# EasyEDA Pro project 无线充电发射板.eprj, board PCB2
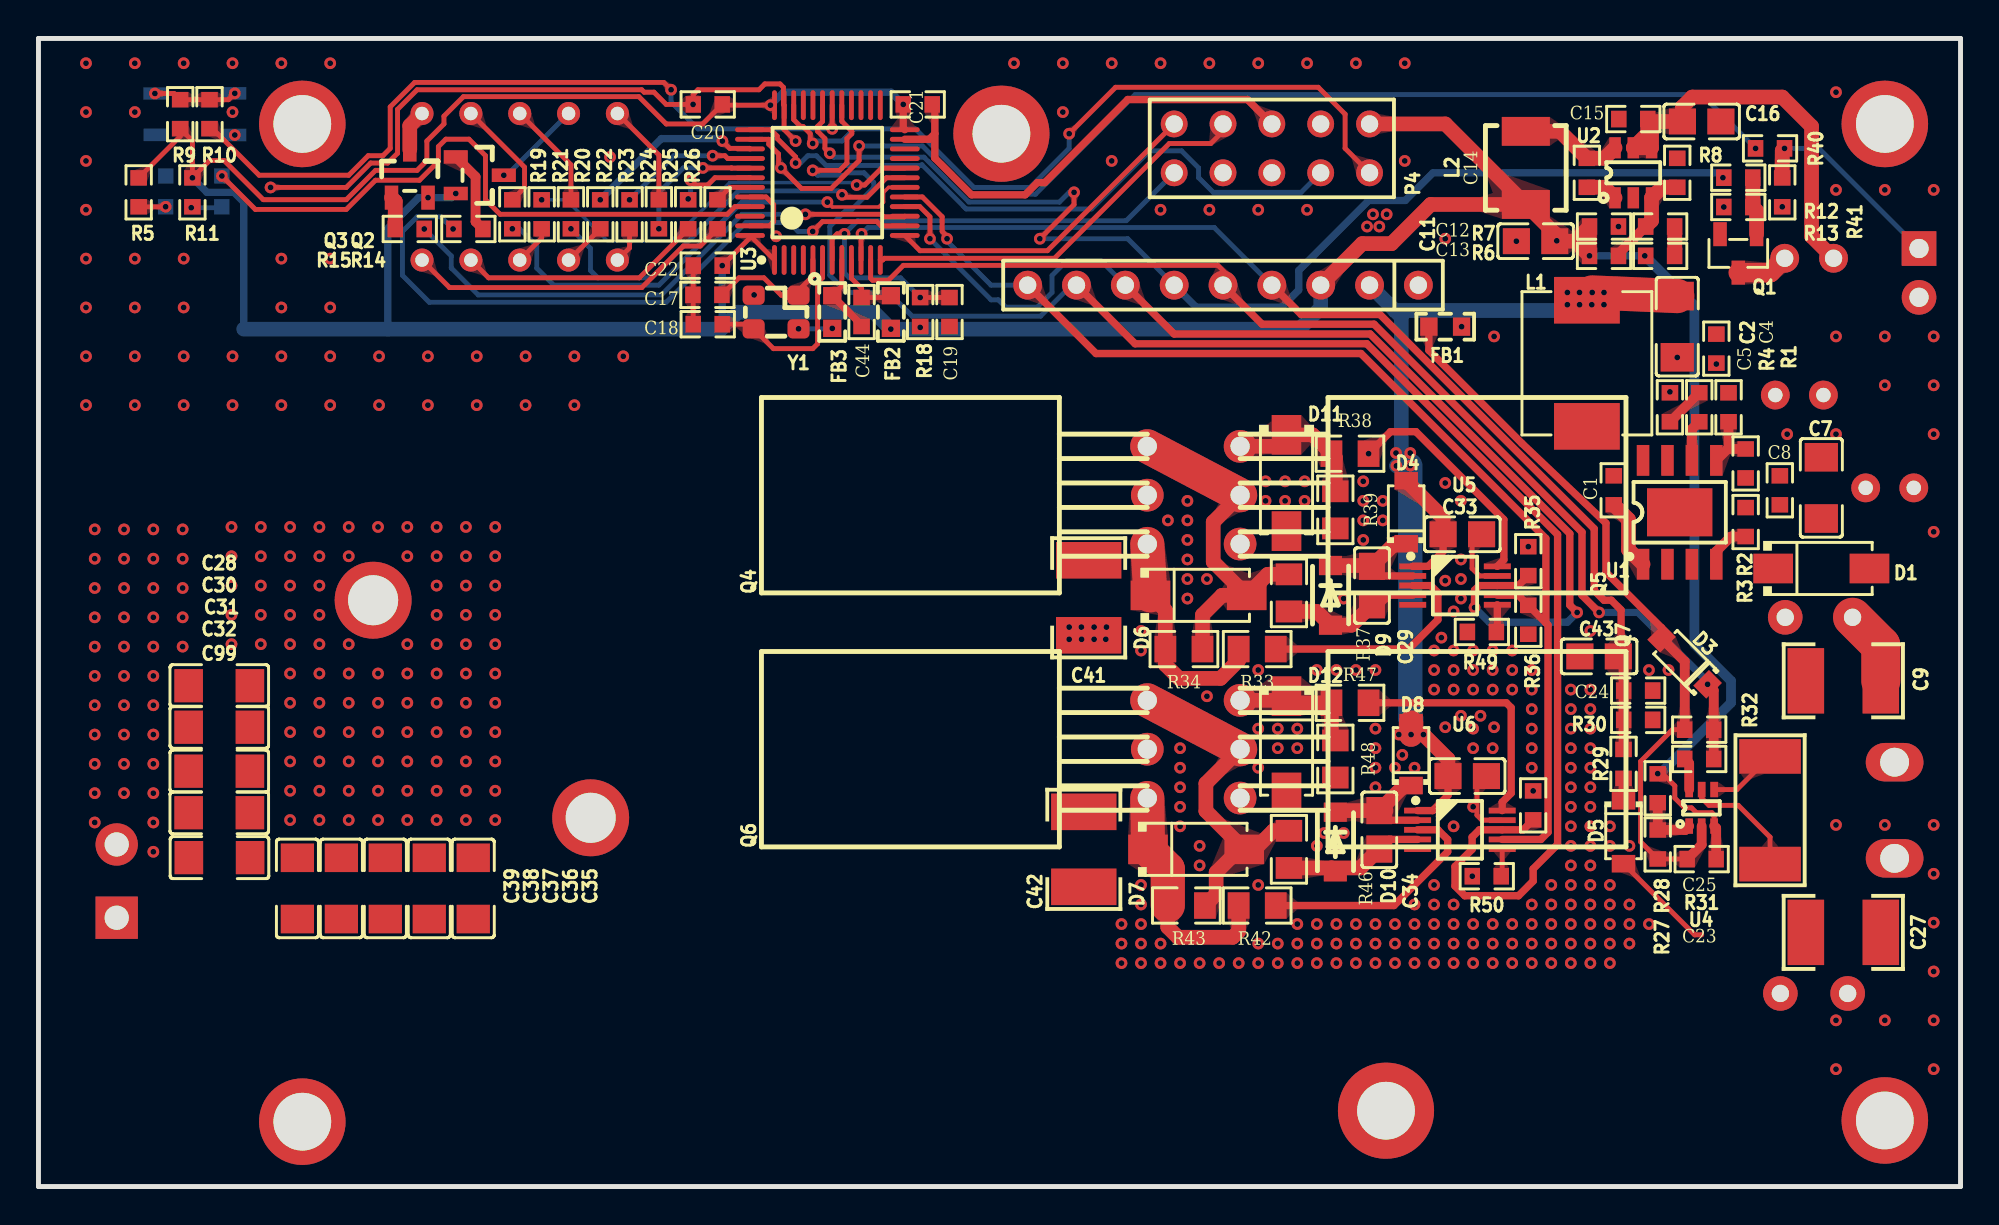
[diagram p1: board, top side]
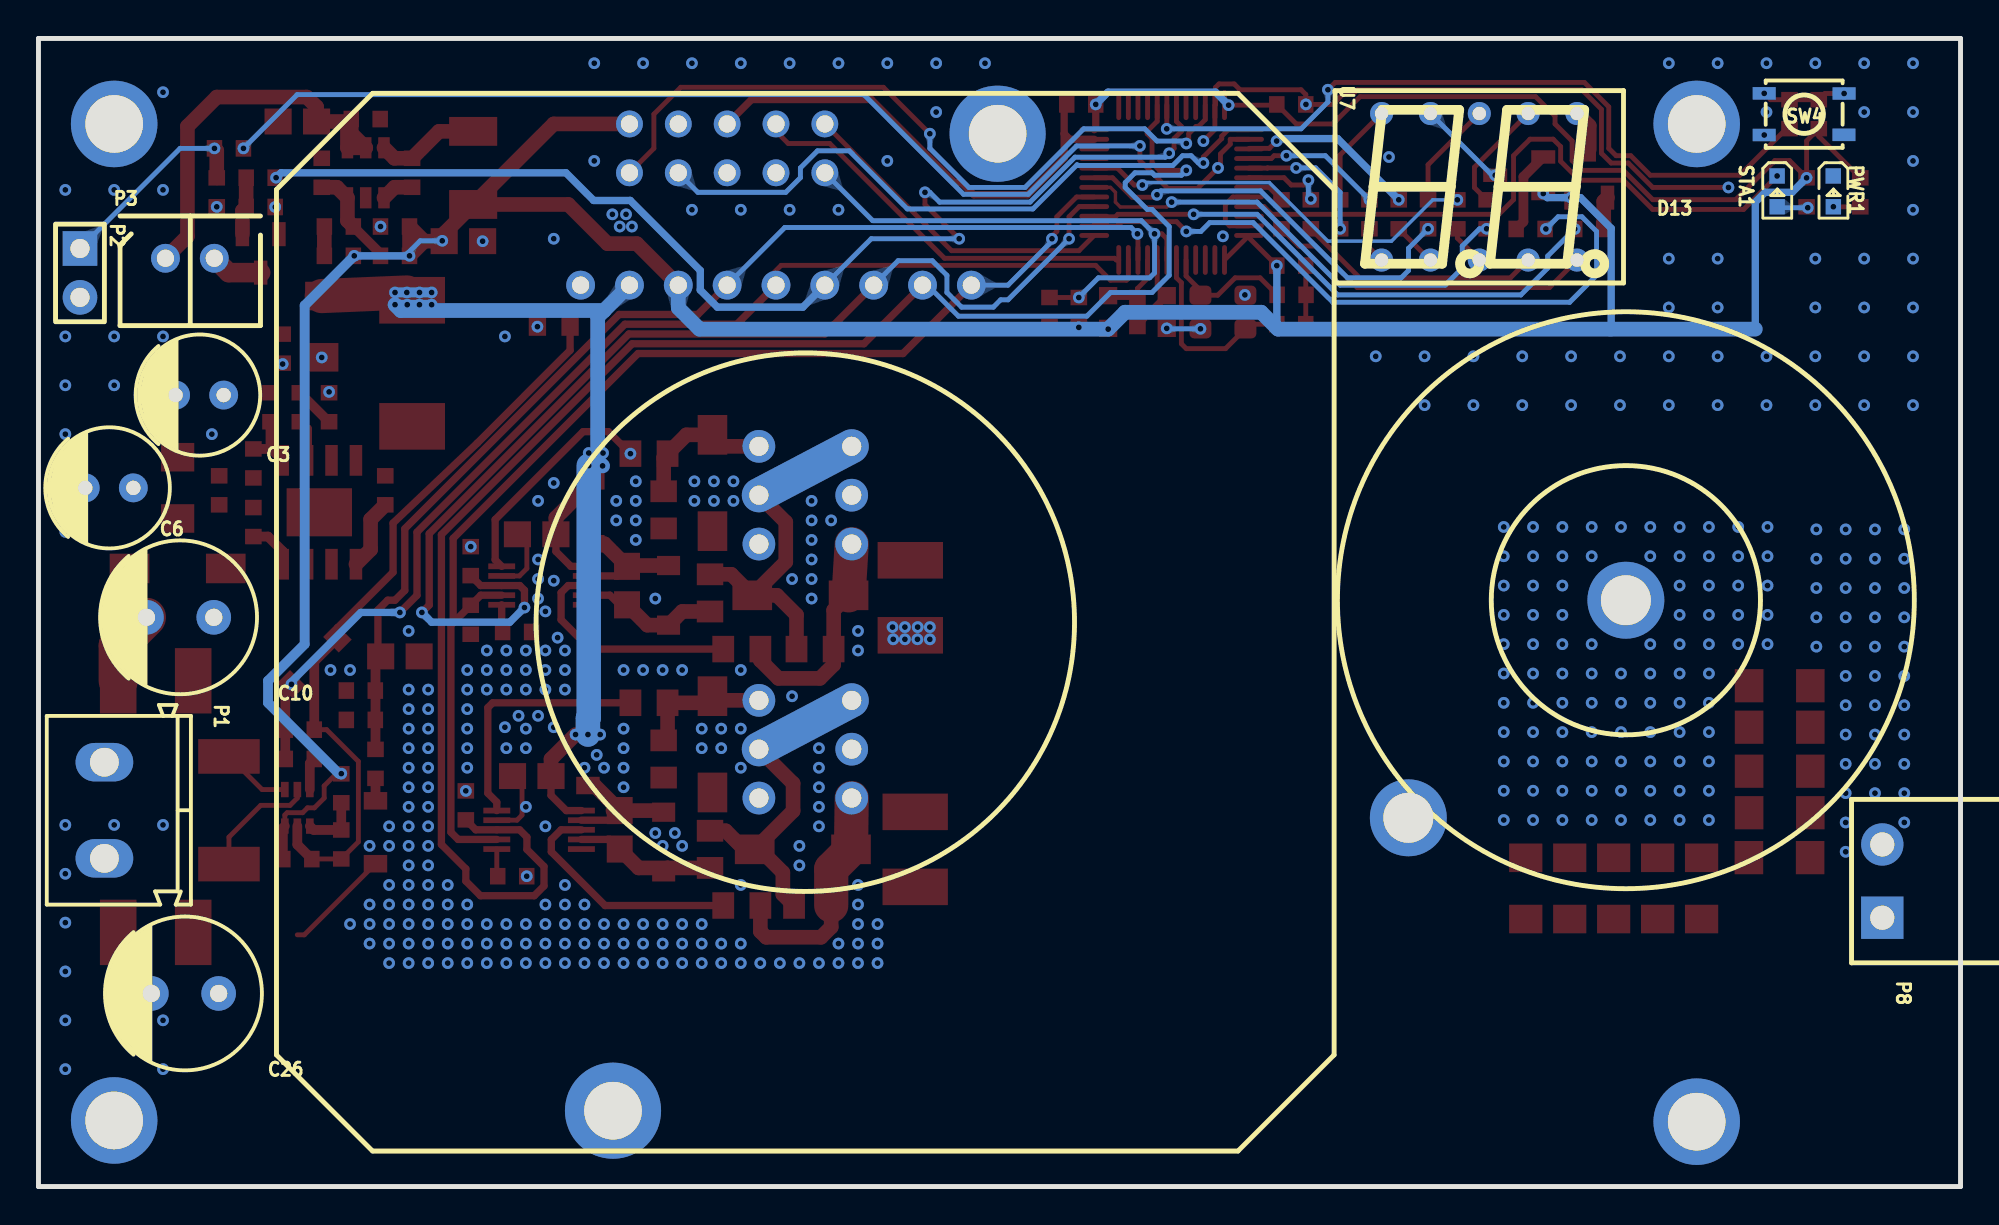
[diagram p2: board, bottom side, seen from below]

Outline 99.95 x 59.7 mm; copper layers: Top Layer, Bottom Layer. Coordinates in mm from the lower left corner of the outline.
Outline path: 0,59.69 0,0 arc(0,0) 0,0 99.95,0 arc(99.95,0) 99.95,0 99.95,59.69 arc(99.95,59.7) 99.95,59.7 0,59.7 arc(0,59.7) 0,59.69
Stack: Top Layer 0.035mm / Dielectric1 1.51mm FR4 er 4.5 / Bottom Layer 0.035mm

## Design rules (mm)
spacing copperThickness1oz (default): track to track 0.102, other pairs 0.152 to 0.3
spacing copperThickness2oz: track to track 0.203, other pairs 0.152 to 0.3
track width copperThickness1oz (default): min 0.127, default 0.254, max 2.54
track width copperThickness2oz: min 0.203, default 0.254, max 2.54
differential pair differentialPair (default): width min 0.127, default 0.254, max 2.54; gap min 0.152, default 0.152
via viaSize (default): diameter min 0.5, default 0.61, max 10; hole min 0.3, default 0.305, max 6.3
net GND uses 111
net VBATO uses 111
net $C6_1 uses 111
net $C28_1 uses 111
net $C28_2 uses 111
net VCC12V uses 111
net VBAT uses 111
net GNDMCU uses 111
net LCCA uses 111
net $C1_2 uses 111
net LCCB uses 111

## Placement (name value [footprint] x y rotation side)
C1  100nF  [R0603]  81.92 36.2 90 top
C2  47uF/25V  [C1206]  85.22 44.71 90 top
C3  220uF  [Cap-S-D 2.5-6.3X8]  91.57 41.16 0 bottom
C4  100nF/50V  [R0603]  87.25 43.57 90 top
C5  4.7nF/50V  [R0603]  84.84 40.52 270 top
C6  100uF  [Cap-S-D 2.5-6.3X8]  96.27 36.33 0 bottom
C7  4.7uF/1206/35V  [C1206]  92.72 36.33 270 top
C8  100nF/50V  [R0603]  90.56 36.2 270 top
C9  47uF  [CAPC4532[1812]S]  93.86 26.3 180 top
C10  470uF  [Cap-S-D 3.5-8x14]  92.59 29.6 0 bottom
C11  22uF  [C0805]  77.86 49.16 0 top
C12  100nF  [R0603]  81.41 49.92 180 top
C13  220pF  [R0603]  81.41 48.39 180 top
C14  100nF  [R0603]  80.52 52.71 90 top
C15  100nF  [R0603]  82.94 55.51 0 top
C16  22uF  [C0805]  86.49 55.38 180 top
C17  18pF/50V/C0G  [R0603]  34.79 46.37 180 top
C18  18pF/50V/C0G  [R0603]  34.8 44.84 0 top
C19  100nF  [R0603]  47.38 45.47 90 top
C20  100nF  [R0603]  34.8 56.27 0 top
C21  100nF  [R0603]  45.72 56.27 180 top
C22  100nF  [R0603]  34.8 47.89 0 top
C23  100nF  [R0603]  86.49 17.03 180 top
C24  100nF  [R0603]  83.19 25.79 180 top
C25  1uF  [R0603]  86.37 23.76 180 top
C26  470uF  [Cap-S-D 3.5-8x14]  92.33 10.04 0 bottom
C27  47uF  [CAPC4532[1812]S]  93.86 13.22 0 top
C28  NC/C0G  [C1206]  9.4 26.04 0 top
C29  10uF  [C0805]  69.35 31.25 90 top
C30  NC/C0G  [C1206]  9.4 23.88 0 top
C31  NC/C0G  [C1206]  9.4 21.6 0 top
C32  NC/C0G  [C1206]  9.4 19.44 0 top
C33  22uF  [C0805]  74.05 33.92 180 top
C34  10uF  [C0805]  69.73 18.55 90 top
C35  NC/C0G  [C1206]  22.61 15.5 90 top
C36  NC/C0G  [C1206]  20.33 15.5 90 top
C37  NC/C0G  [C1206]  18.04 15.5 90 top
C38  NC/C0G  [C1206]  15.75 15.5 90 top
C39  NC/C0G  [C1206]  13.47 15.5 90 top
C40  22uF  [C0805]  74.3 21.34 180 top
C41  47uF  [CAPC4532[1812]S]  54.62 30.61 90 top
C42  47uF  [CAPC4532[1812]S]  54.36 17.53 90 top
C43  10uF  [C0805]  81.16 27.57 0 top
C44  100nF  [R0603]  42.8 45.47 270 top
C99  NC/C0G  [C1206]  9.41 17.1 0 top
D1  SS54  [SMA_L4.4-W2.8-LS5.4-R-RD]  92.72 32.14 0 top
D3  SMF3.3A  [SOD-123_L2.8-W1.8-LS3.7-RD]  85.6 27.31 135 top
D4  1N4148  [SOD-123_L2.7-W1.6-LS3.7-RD]  71.12 35.06 90 top
D5  1N4148  [SOD-123_L2.7-W1.6-LS3.7-RD]  82.43 18.42 270 top
D6  SS54  [SMA_L4.4-W2.8-LS5.4-R-RD]  60.33 30.74 0 top
D7  SS54  [SMA_L4.4-W2.8-LS5.4-R-RD]  60.2 17.53 0 top
D8  1N4148  [SOD-123_L2.7-W1.6-LS3.7-RD]  71.38 22.49 90 top
D9  SMF12A  [SOD-123F_L2.8-W1.8-LS3.7-RD]  67.19 30.74 270 top
D10  SMF12A  [SOD-123F_L2.8-W1.8-LS3.7-RD]  67.44 17.91 270 top
D11  SS54  [SMA_L4.4-W2.8-LS5.4-R-RD]  64.9 36.58 270 top
D12  SS54  [SMA_L4.4-W2.8-LS5.4-R-RD]  64.9 22.99 270 top
D13  2821BS  [2821AS/BS]  25.03 51.98 180 bottom
FB1  0R  [INDC1608[0603]S]  73.16 44.71 180 top
FB2  0R  [INDC1608[0603]S]  44.33 45.47 90 top
FB3  0R  [INDC1608[0603]S]  41.28 45.47 270 top
L1  4.7uH  [IND-SMD_L7.3-W6.6]  80.52 42.81 270 top
L2  3.3uH  [0402 TPC 4*4*2]  77.35 52.97 90 top
L3  3.722uH  [T94/106-LAY]  17.4 30.49 315 bottom
NOREF  -  [Pad_e1420]  13.72 3.37 0 top
NOREF#2  -  [Pad_e61]  96.02 55.25 0 top
NOREF#3  -  [Pad_e104]  96.02 3.44 0 top
NOREF#4  -  [Pad_e584]  13.72 55.25 0 top
P1  KF301  [KF/WJ/DG 301-2p-5.0mm]  96.53 19.57 270 bottom
P2  2P  [HDR-TH_2P-P2.54-V-M-1]  97.79 47.51 270 bottom
P3  XH2.54-2P  [XH2.54-2P-DV]  93.35 48.27 180 bottom
P4  SWD  [HDR2X5-M]  69.22 55.25 180 top
P5  Header-D-M1x9P  [HDR1X9-M]  71.76 46.87 180 top
P8  WJ15EDGRC-3.81-2P  [CONN-TH_2P-P3.81_WJ15EDGRC-3.81-2P]  4.07 15.88 90 bottom
PWR1  -  [LED_0603]  6.61 51.7 270 bottom
Q1  -  [SOT-23-3_L2.9-W1.3-P1.90-LS2.4-BR]  88.4 48.52 90 top
Q2  -  [S8550P_SOT]  22.99 52.59 180 top
Q3  -  [S8550P_SOT]  19.31 52.71 270 top
Q4  HYG180N10LS1P  [TO-220-LAY]  57.66 33.41 90 top
Q5  HYG180N10LS1P  [TO-220-LAY]  62.49 38.49 270 top
Q6  HYG180N10LS1P  [TO-220-LAY]  57.66 20.2 90 top
Q7  HYG180N10LS1P  [TO-220-LAY]  62.49 25.28 270 top
R1  140K  [R0603]  87.89 40.52 90 top
R2  10K  [R0603]  88.78 37.6 90 top
R3  200K  [R0603]  88.78 34.55 270 top
R4  20K  [R0603]  86.37 40.52 270 top
R5  2.7K  [R0603]  5.21 51.7 90 top
R6  30K  [R0603]  84.33 48.39 180 top
R7  15K  [R0603]  84.33 49.92 0 top
R8  10K  [R0603]  85.22 52.71 270 top
R9  10K  [R0603]  7.37 55.76 90 top
R10  100R  [R0603]  8.89 55.76 90 top
R11  2.7K  [R0603]  8.01 51.7 270 top
R12  100R  [R0603]  88.4 52.46 0 top
R13  10K  [R0603]  88.4 50.93 180 top
R14  100R  [R0603]  22.36 49.79 180 top
R15  100R  [R0603]  19.31 49.79 0 top
R18  10K  [R0603]  45.85 45.47 90 top
R19  1K  [R0603]  24.64 50.55 90 top
R20  1K  [R0603]  27.69 50.55 90 top
R21  1K  [R0603]  26.17 50.55 270 top
R22  1K  [R0603]  29.22 50.55 270 top
R23  1K  [R0603]  30.74 50.55 270 top
R24  1K  [R0603]  32.26 50.55 90 top
R25  1K  [R0603]  33.79 50.55 270 top
R26  1K  [R0603]  35.31 50.55 270 top
R27  0R  [R0603]  84.21 17.79 270 top
R28  NC/0R  [R0603]  84.21 20.71 270 top
R29  5.1K  [R0603]  82.43 21.98 270 top
R30  510R  [R0603]  83.19 24.26 180 top
R31  1K  [R0603]  86.37 22.23 180 top
R32  2mR  [RESC6332[2512]S]  90.05 19.57 270 top
R33  10R  [R0805_NEW]  63.38 27.95 180 top
R34  10K  [R0805_NEW]  59.57 27.95 0 top
R35  10K  [R0603]  77.47 32.52 90 top
R36  10K  [R0603]  77.47 29.47 270 top
R37  2.2R  [R0805_NEW]  65.03 30.87 90 top
R38  10R  [R0805_NEW]  68.2 38.11 180 top
R39  10K  [R0805_NEW]  67.44 35.19 270 top
R40  100R  [R0603]  90.05 53.98 0 top
R41  10K  [R0603]  90.68 51.7 90 top
R42  10R  [R0805_NEW]  63.38 14.61 180 top
R43  10K  [R0805_NEW]  59.69 14.61 0 top
R44  10K  [R0603]  77.73 19.82 90 top
R46  2.2R  [R0805_NEW]  65.03 17.53 90 top
R47  10R  [R0805_NEW]  68.2 25.15 180 top
R48  10K  [R0805_NEW]  67.44 22.23 270 top
R49  10K  [R0603]  75.06 28.84 180 top
R50  10K  [R0603]  75.32 16.14 180 top
STA1  -  [LED_0603]  9.53 51.7 270 bottom
SW4  PTS810SJG250SMTRLFS  [SW-SMD_4P_PTS810SJM250SMTRLFS]  8.13 55.76 180 bottom
U1  -  [SP1N28STER]  85.35 35.06 90 top
U2  RY8121  [SOT-23-6]  82.94 52.71 90 top
U3  CH32V203CxT6  [LQFP48_L]  41.03 52.2 90 top
U4  TP181A1  [SOT-363]  86.49 19.69 90 top
U5  DGD0506A  [MSOP-10]  73.66 31.25 0 top
U6  DGD0506A  [MSOP-10]  73.92 18.55 0 top
U7  -  [Cooler-5.5]  60.08 29.34 270 bottom
Y1  8MHz/20PF  [X3225-4]  38.36 45.47 180 top

## Footprints (pads in the part's own frame, mm; a bottom-side part is the same pattern mirrored in y, then rotated)
0402 TPC 4*4*2
  rect 1.5x2.5 smd: 1(-1.9,0) 2(1.9,0)
2821AS/BS
  round 1.2 hole 0.7: 1(-5.08,-3.81) 2(-2.54,-3.81) 3(0,-3.81) 4(2.54,-3.81) 5(5.08,-3.81) 6(5.08,3.81) 7(2.54,3.81) 8(0,3.81) 9(-2.54,3.81) 10(-5.08,3.81)
C0805
  rect 1.41x1.35 smd: 1(-1,0) 2(1,0)
C1206
  rect 1.485x1.728 smd: 1(-1.593,0) 2(1.593,0)
Cap-S-D 2.5-6.3X8
  rrect 1.5x1.5 hole 0.75: 1(-1.25,0)
  round 1.5 hole 0.75: 2(1.25,0)
Cap-S-D 3.5-8x14
  rrect 1.8x1.8 hole 0.9: 1(-1.75,0)
  round 1.8 hole 0.9: 2(1.75,0)
CAPC4532[1812]S
  rect 1.9x3.4 smd: 1(-1.95,0) 2(1.95,0)
CONN-TH_2P-P3.81_WJ15EDGRC-3.81-2P
  rect 2.2x2.2 hole 1.26: 1(-1.905,0)
  round 2.2 hole 1.26: 2(1.905,0)
Cooler-5.5
  round 5 hole 3: 0(-25.4,10) 0(25.4,-10)
HDR1X9-M
  round 1.5 hole 0.9: 1(0,0) 2(2.54,0) 3(5.08,0) 4(7.62,0) 5(10.16,0) 6(12.7,0) 7(15.24,0) 8(17.78,0) 9(20.32,0)
HDR2X5-M
  round 1.397 hole 0.9: 1(0,0) 2(0,2.54) 3(2.54,0) 4(2.54,2.54) 5(5.08,0) 6(5.08,2.54) 7(7.62,0) 8(7.62,2.54) 9(10.16,0) 10(10.16,2.54)
HDR-TH_2P-P2.54-V-M-1
  rect 1.8x1.8 hole 1: 1(-1.27,0)
  round 1.8 hole 1: 2(1.27,0)
IND-SMD_L7.3-W6.6
  rect 2.424x3.42 smd: 1(3.278,0) 2(-3.278,0)
INDC1608[0603]S
  rect 0.9x0.95 smd: 1(-0.85,0) 2(0.85,0)
KF/WJ/DG 301-2p-5.0mm
  oval 2x3 hole 1.5: 1(2.5,0) 2(-2.5,0)
LED_0603
  rect 0.8x0.8 smd: 1(-0.851,-0.01) 2(0.75,-0.005)
LQFP48_L
  oval 1.55x0.254 smd: 1(-4.025,2.75) 2(-4.025,2.25) 3(-4.025,1.75) 4(-4.025,1.25) 5(-4.025,0.75) 6(-4.025,0.25) 7(-4.025,-0.25) 8(-4.025,-0.75) 9(-4.025,-1.25) 10(-4.025,-1.75) 11(-4.025,-2.25) 12(-4.025,-2.75) 25(4.025,-2.75) 26(4.025,-2.25) 27(4.025,-1.75) 28(4.025,-1.25) 29(4.025,-0.75) 30(4.025,-0.25) 31(4.025,0.25) 32(4.025,0.75) 33(4.025,1.25) 34(4.025,1.75) 35(4.025,2.25) 36(4.025,2.75)
  oval 0.254x1.55 smd: 13(-2.75,-4.025) 14(-2.25,-4.025) 15(-1.75,-4.025) 16(-1.25,-4.025) 17(-0.75,-4.025) 18(-0.25,-4.025) 19(0.25,-4.025) 20(0.75,-4.025) 21(1.25,-4.025) 22(1.75,-4.025) 23(2.25,-4.025) 24(2.75,-4.025) 37(2.75,4.025) 38(2.25,4.025) 39(1.75,4.025) 40(1.25,4.025) 41(0.75,4.025) 42(0.25,4.025) 43(-0.25,4.025) 44(-0.75,4.025) 45(-1.25,4.025) 46(-1.75,4.025) 47(-2.25,4.025) 48(-2.75,4.025)
MSOP-10
  rect 1.4x0.3 smd: 1(-2.2,1) 2(-2.2,0.5) 3(-2.2,0) 4(-2.2,-0.5) 5(-2.2,-1) 6(2.2,-1) 7(2.2,-0.5) 8(2.2,0) 9(2.2,0.5) 10(2.2,1)
Pad_e61
  round 4.5 hole 3: 1(0,0)
Pad_e104
  round 4.5 hole 3: 1(0,0)
Pad_e584
  round 4.5 hole 3: 1(0,0)
Pad_e1420
  round 4.5 hole 3: 1(0,0)
R0603
  rect 0.806x0.864 smd: 1(-0.753,0) 2(0.753,0)
R0805_NEW
  rect 1.133x1.377 smd: 1(-0.966,0) 2(0.966,0)
RESC6332[2512]S
  rect 1.8x3.2 smd: 1(-2.8,0) 2(2.8,0)
S8550P_SOT
  rect 1.25x0.701 smd: 1(1.292,-0.95) 2(1.292,0.95) 3(-1.208,0)
SMA_L4.4-W2.8-LS5.4-R-RD
  rect 2.062x1.539 smd: 1(2.503,0) 2(-2.503,0)
SOD-123_L2.7-W1.6-LS3.7-RD
  rect 0.91x1.22 smd: 1(-1.635,0) 2(1.635,0)
SOD-123_L2.8-W1.8-LS3.7-RD
  rect 0.95x1.15 smd: 1(-1.692,0) 2(1.692,0)
SOD-123F_L2.8-W1.8-LS3.7-RD
  rect 1x1.2 smd: 1(-1.55,0) 2(1.55,0)
SOT-23-3_L2.9-W1.3-P1.90-LS2.4-BR
  rect 1.25x0.7 smd: 1(1,-0.95) 2(1,0.95) 3(-1,0)
SOT-23-6
  rect 1.1x0.6 smd: 1(-1.3,0.95) 2(-1.3,0) 3(-1.3,-0.95) 4(1.3,-0.95) 5(1.3,0) 6(1.3,0.95)
SOT-363
  rect 0.8x0.4 smd: 1(-0.95,0.65) 2(-0.95,0) 3(-0.95,-0.65) 4(0.95,-0.65) 5(0.95,0) 6(0.95,0.65)
SP1N28STER
  rect 2.5x3.4 smd: 0(0,0)
  rect 1.6x0.65 smd: 1(-2.7,1.905) 2(-2.7,0.635) 3(-2.7,-0.635) 4(-2.7,-1.905) 5(2.7,-1.905) 6(2.7,-0.635) 7(2.7,0.635) 8(2.7,1.905)
SW-SMD_4P_PTS810SJM250SMTRLFS
  rect 1.2x0.65 smd: 1(-2.078,1.083) 2(2.078,1.075) 3(-2.077,-1.083) 4(2.071,-1.075)
T94/106-LAY
  round 4 hole 2.6: 1(0,0) 2(16,0)
TO-220-LAY
  round 1.7 hole 1: 1(0,0) 2(2.54,0) 3(5.08,0)
X3225-4
  rrect 1.143x1 smd: 1(-1.169,-0.874) 2(1.169,-0.874) 3(1.169,0.874) 4(-1.169,0.874)
XH2.54-2P-DV
  rrect 1.5x1.5 hole 0.9: 1(0,0)
  round 1.5 hole 0.9: 2(2.54,0)

## Nets
As in the schematic.

Pads without a net: NOREF 1; NOREF#2 1; NOREF#3 1; NOREF#4 1; P4 6 8; U3 2 3 4 21 22 25 26 27 28 32 33 46; U5 5; U6 5; U7 0

## Via types
v1: diameter 0.61, hole 0.305, Top Layer to Bottom Layer, 525 vias

## Routing (per net, layer and track width the routed paths; a pad name or vN(x,y) marks a point on that pad's centre or on a via; arc(x,y) is an arc through that point)
GND: length 11
  Top Layer w0.254: U6.9 75.07,19.05 74.81,19.31 74.81,20.85 C40.1 ; U5.9 74.94,31.75 74.55,32.14 74.55,33.42 C33.1
  Top Layer w2.032: C9.1 95.81,28.13 C10.2
  vias: v1(53.6,29.09) v1(53.6,28.46) v1(54.23,29.09) v1(54.25,28.46) v1(54.9,29.09) v1(54.9,28.46) v1(55.54,29.09) v1(55.5,28.46) v1(56.32,13.65) v1(56.32,12.63) v1(56.32,11.62) v1(57.34,28.89) v1(57.34,27.87) v1(57.34,15.68) v1(57.34,14.67) v1(57.34,13.65) v1(57.34,12.63) v1(57.34,11.62) v1(58.35,12.63) v1(58.35,11.62) v1(58.73,34.64) v1(59.37,22.79) v1(59.37,21.78) v1(59.37,20.76) v1(59.37,19.75) v1(59.37,18.73) v1(59.37,11.62) v1(59.75,35.65) v1(59.75,34.64) v1(59.75,33.62) v1(59.75,32.61) v1(59.75,31.59) v1(59.75,30.57) v1(60.38,17.71) v1(60.38,16.7) v1(60.38,11.62) v1(60.76,31.59) v1(60.76,25.49) v1(61.4,11.62) v1(62.42,11.62) v1(63.43,26.86) v1(63.43,23.81) v1(63.43,21.78) v1(63.43,15.68) v1(63.43,12.63) v1(63.43,11.62) v1(63.81,36.67) v1(63.81,35.65) v1(64.45,23.81) v1(64.45,22.79) v1(64.45,12.63) v1(64.45,11.62) v1(64.83,36.67) v1(64.83,35.65) v1(65.46,23.81) v1(65.46,22.79) v1(65.46,13.65) v1(65.46,12.63) v1(65.46,11.62) v1(65.84,36.67) v1(65.84,35.65) v1(66.48,26.86) v1(66.48,17.71) v1(66.48,13.65) v1(66.48,12.63) v1(66.48,11.62) v1(66.86,18.38) v1(67.5,26.86) v1(67.5,17.71) v1(67.5,13.65) v1(67.5,12.63) v1(67.5,11.62) v1(67.88,30.57) v1(67.88,18.38) v1(68.51,26.86) v1(68.51,13.65) v1(68.51,12.63) v1(68.51,11.62) v1(68.89,36.67) v1(68.89,35.65) v1(68.89,34.64) v1(68.89,33.62) v1(69.53,26.86) v1(69.53,23.81) v1(69.53,22.79) v1(69.53,21.78) v1(69.53,20.76) v1(69.53,13.65) v1(69.53,12.63) v1(69.53,11.62) v1(69.91,35.65) v1(69.91,34.64) v1(70.54,21.78) v1(70.54,13.65) v1(70.54,12.63) v1(70.54,11.62) v1(70.92,22.45) v1(71.56,21.78) v1(71.56,14.67) v1(71.56,13.65) v1(71.56,12.63) v1(71.56,11.62) v1(72.58,27.87) v1(72.58,26.86) v1(72.58,25.84) v1(72.58,15.68) v1(72.58,14.67) v1(72.58,13.65) v1(72.58,12.63) v1(72.58,11.62) v1(72.96,28.54) v1(73.16,49.28) v1(73.16,36.58) v1(73.16,31.5) v1(73.16,23.88) v1(73.59,29.91) v1(73.59,27.87) v1(73.59,26.86) v1(73.59,25.84) v1(73.59,18.73) v1(73.59,14.67) v1(73.59,13.65) v1(73.59,12.63) v1(73.59,11.62) v1(74.01,44.71) v1(73.97,35.65) v1(73.97,32.61) v1(73.97,31.59) v1(73.97,30.57) v1(73.97,24.48) v1(74.61,27.87) v1(74.61,26.86) v1(74.61,25.84) v1(74.61,23.81) v1(74.61,22.79) v1(74.61,19.75) v1(74.56,16.14) v1(74.61,13.65) v1(74.61,12.63) v1(74.61,11.62) v1(74.99,24.48) v1(75.62,27.87) v1(75.62,26.86) v1(75.62,25.84) v1(75.62,22.79) v1(75.62,13.65) v1(75.62,12.63) v1(75.62,11.62) v1(75.7,44.2) v1(75.7,23.88) v1(76.64,27.87) v1(76.64,26.86) v1(76.64,25.84) v1(76.64,13.65) v1(76.64,12.63) v1(76.64,11.62) v1(76.86,49.16) v1(77.47,33.27) v1(77.66,26.86) v1(77.66,25.84) v1(77.66,24.83) v1(77.66,23.81) v1(77.66,22.79) v1(77.66,21.78) v1(77.73,20.57) v1(77.66,14.67) v1(77.66,13.65) v1(77.66,12.63) v1(77.66,11.62) v1(78.67,15.68) v1(78.67,14.67) v1(78.67,13.65) v1(78.67,12.63) v1(78.67,11.62) v1(79.69,25.84) v1(79.69,24.83) v1(79.69,23.81) v1(79.69,22.79) v1(79.69,21.78) v1(79.69,20.76) v1(79.69,19.75) v1(79.69,18.73) v1(79.69,17.71) v1(79.69,16.7) v1(79.69,15.68) v1(79.69,14.67) v1(79.69,13.65) v1(79.69,12.63) v1(79.69,11.62) v1(80.7,28.89) v1(80.7,25.84) v1(80.7,24.83) v1(80.7,23.81) v1(80.7,22.79) v1(80.7,21.78) v1(80.7,20.76) v1(80.7,19.75) v1(80.7,18.73) v1(80.7,17.71) v1(80.7,16.7) v1(80.7,15.68) v1(80.7,14.67) v1(80.7,13.65) v1(80.7,12.63) v1(80.7,11.62) v1(81.72,18.73) v1(81.72,17.71) v1(81.72,15.68) v1(81.72,14.67) v1(81.72,13.65) v1(81.72,12.63) v1(81.72,11.62) v1(82.17,49.92) v1(82.74,17.71) v1(82.74,14.67) v1(82.74,13.65) v1(82.74,12.63) v1(83.75,26.86) v1(83.75,13.65) v1(84.84,41.32) v1(84.77,26.86) v1(85.22,43.11) v1(87.25,42.77) v1(87.64,50.93) v1(90.68,50.94) v1(90.94,39.12) v1(93.48,56.9) v1(93.48,51.82) v1(93.48,44.2) v1(93.48,39.12) v1(93.48,18.8) v1(93.48,8.64) v1(93.48,6.1) v1(96.02,51.82) v1(96.02,44.2) v1(96.02,41.66) v1(96.02,18.8) v1(96.02,8.64) v1(98.56,51.82) v1(98.56,44.2) v1(98.56,41.66) v1(98.56,39.12) v1(98.56,34.04) v1(98.56,18.8) v1(98.56,16.26) v1(98.56,13.72) v1(98.56,11.18) v1(98.56,8.64) v1(98.56,6.1)
GNDMCU: length 106.7
  Top Layer w0.254: C23.2 85.73,17.03 R27.2 83.32,17.92 83.32,22.11 84.97,23.76 C25.2 ; U3.47 38.01,49.95 38.23,50.17 38.23,51.06 37.84,51.45 U3.44 ; v1(12.07,51.95) 16.01,51.95 17.28,53.22 18.17,53.22 18.67,53.73 18.67,56.01 19.69,57.03 31.37,57.03 31.5,56.9 32.01,56.9 32.64,56.27 C20.1 34.05,56.78 34.29,57.03 37.47,57.03 37.77,57.33 38.56,57.33 38.74,57.16 38.74,56.27 U3.35 38.78,54.96 v1(39.38,54.36) ; C18.1 C22.1
  Top Layer w0.381: C21.1 46.61,56.13 46.61,54.74 ; 46.61,54.74 46.32,54.45 U3.23 ; 46.61,54.74 46.61,53.47 48.52,51.57 51.31,51.57 51.95,52.2 52.33,52.2 56.65,56.52 62.87,56.52 P4.5 ; D3.2 84.41,29.05 81.51,31.94 81.51,34.5 77.14,38.65 72.31,43.48 FB1.2
  Top Layer w0.508: D3.2 85.61,27.3 C25.2 ; C23.2 86.49,17.78 U4.2
  Bottom Layer w0.254: v1(41.28,44.62) 41.26,44.6 v1(39.53,44.6)
  vias: v1(2.47,58.41) v1(2.47,55.87) v1(2.47,53.33) v1(2.47,50.79) v1(2.47,48.25) v1(2.47,45.71) v1(2.47,43.17) v1(2.47,40.63) v1(5.01,58.41) v1(5.01,55.87) v1(5.01,48.25) v1(5.01,45.71) v1(5.01,43.17) v1(5.01,40.63) v1(7.55,58.41) v1(7.55,48.25) v1(7.55,45.71) v1(7.55,43.17) v1(7.55,40.63) v1(10.09,58.41) v1(10.09,55.87) v1(10.09,43.17) v1(10.09,40.63) v1(10.21,54.68) v1(12.63,58.41) v1(12.63,48.25) v1(12.63,45.71) v1(12.63,43.17) v1(12.63,40.63) v1(15.17,58.41) v1(15.17,48.25) v1(15.17,45.71) v1(15.17,43.17) v1(15.17,40.63) v1(17.71,43.17) v1(17.71,40.63) v1(20.25,43.17) v1(20.25,40.63) v1(22.79,43.17) v1(22.79,40.63) v1(25.33,43.17) v1(25.33,40.63) v1(27.87,43.17) v1(27.87,40.63) v1(29.72,53.53) v1(30.41,43.17) v1(34.04,56.27) v1(37.22,46.36) v1(38.36,49.41) v1(50.73,58.41) v1(53.27,58.41) v1(53.27,55.87) v1(55.81,58.41) v1(55.81,53.33) v1(58.35,58.41) v1(58.35,50.79) v1(60.89,58.41) v1(60.89,50.79) v1(63.43,58.41) v1(63.43,50.79) v1(65.97,58.41) v1(65.97,50.79) v1(68.51,58.41) v1(69.09,49.92) v1(69.4,50.55) v1(69.73,49.92) v1(70.11,50.55) v1(71.05,58.41) v1(71.05,53.33)
VBAT: length 3.6
  Top Layer w0.254: U4.4 88.32,20.64 R32.1
VBATO: length 11.8
  Top Layer w0.254: D5.2 86.13,13.09 86.49,13.09 ; R32.2 90.05,18.17 88.4,19.82 86.87,19.82 86.49,20.2 U4.5
VCC3V3: length 207.1
  Top Layer w0.254: U3.1 U3.48 37,49.33 v1(35.56,47.89) ; v1(8.01,52.45) 8.01,52.46 ; 8.01,52.46 8.89,53.35 9.66,53.35 11.69,51.32 16.01,51.32 17.53,52.84 19.69,52.84 20.2,53.35 20.2,54.36 21.09,55.25 21.09,55.66 22.1,56.67 31.22,56.67 32.64,55.25 34.54,55.25 C20.2 35.6,56.23 U3.36 ; 8.01,52.46 8.01,54.37 R9.1 7.37,54.61 R5.2 ; R28.1 84.47,21.46 85.09,20.84 85.09,20.2 85.6,19.69 85.96,19.69 86.22,19.44 87.02,19.44 87.14,19.32 U4.3
  Top Layer w0.381: U3.24 44.97,55.03 v1(44.97,56.27)
  Top Layer w0.508: U4.3 87.25,18.64 C23.1
  Top Layer w0.762: 79.9,49.16 C11.2 78.86,49.56 L2.1 ; 79.9,49.16 C12.2 v1(80.66,48.39) 79.9,49.16 ; L2.1 73.16,55.25 P4.1 ; L2.1 72.4,51.07 70.36,49.03 68.84,49.03 P5.3
  Bottom Layer w0.254: v1(78.96,49.18) 80.1,49.18 80.88,48.39
  Bottom Layer w0.381: 38.07,56.23 38.74,56.9 44.34,56.9 v1(44.97,56.27) ; 18.2,44.58 18.17,44.62 18.17,49.82 19.76,51.42 v1(20.26,51.42) 21.49,51.42 v1(21.7,51.64) ; v1(80.66,48.39) v1(83.53,48.39) ; 10.67,44.58 10.67,51.19 10.16,51.7 8.76,51.7 v1(8.01,52.45) ; v1(35.56,47.89) 35.56,44.65
  Bottom Layer w0.508: v1(84.21,21.47) 84.33,21.47 88.02,25.15 88.02,26.3 86.11,28.2 86.11,45.82 v1(83.53,48.39)
  Bottom Layer w0.762: P5.3 66.68,45.69 65.58,44.58 v1(44.33,44.58) 43.45,45.46 36.37,45.46 35.56,44.65 35.49,44.58 10.67,44.58
  vias: v1(38.06,56.23) v1(45.85,44.67)
VCC12V: length 77.7
  Top Layer w0.381: C40.2 73.3,20.34 72.51,19.55 U6.1 ; C33.2 73.05,33.03 72.27,32.25 U5.1
  Top Layer w0.762: 83.82,55.38 C15.2 83.69,54.77 U2.5 U2.4 83.89,55.31 83.82,55.38 ; 83.82,55.38 C16.2 85.49,56.14 86,56.65 90.68,56.65 92.21,55.13 92.21,49.41 P3.1 ; C40.2 73.3,22.23 v1(72.02,23.5) ; D4.2 73.05,34.77 C33.2
  Top Layer w1.27: v1(71.38,23.5) D8.2
  Top Layer w1.778: v1(80.8,46.49) C2.2
  Bottom Layer w0.508: v1(81.41,46.49) v1(80.8,46.49) v1(80.14,46.49) v1(79.51,46.49) ; v1(81.41,45.85) v1(80.78,45.85) v1(80.14,45.85) v1(79.51,45.85)
  Bottom Layer w0.762: 70.54,45.55 81.11,45.55 v1(81.41,45.85) ; 70.54,45.55 70.87,45.22 70.87,37.73 v1(70.62,37.47) ; 70.54,45.55 P5.2
  Bottom Layer w1.27: v1(71.34,37.49) 71.34,24.39 71.38,24.35 v1(71.38,23.5)
  vias: v1(70.6,38.14) v1(70.74,23.5) v1(71.34,38.14)
$C1_1: length 3.7
  Top Layer w0.762: U1.1 82.68,33.12 82.68,34.69 C1.1
$C5_2: length 2.1
  Top Layer w0.508: R4.1 84.86,39.77 C5.2
$C13_1: length 5.3
  Top Layer w0.508: C13.1 82.17,48.5 R7.1
  Top Layer w0.762: R7.1 83.89,50.22 U2.3 84.43,51.96 R8.2
$C14_1: length 1.7
  Top Layer w0.762: C14.1 81.44,51.96 U2.1
$C14_2: length 5.4
  Top Layer w0.762: U2.6 81.44,53.47 C14.2 79.12,54.87 L2.2
$C17_1: length 6.9
  Top Layer w0.254: U3.5 40.28,47.35 39.53,46.6 Y1.1 38.63,46.35 37.72,47.25 36.42,47.25 C17.1
$C18_2: length 10.1
  Top Layer w0.254: C18.2 36.95,44.84 Y1.3 38.22,43.57 40.26,43.57 40.52,43.82 40.52,47 40.78,47.26 U3.6
$C28_1:
  vias: v1(2.93,34.17) v1(2.93,32.65) v1(2.93,31.12) v1(2.93,29.6) v1(2.93,28.07) v1(2.93,26.55) v1(2.93,25.03) v1(2.93,23.5) v1(2.93,21.98) v1(2.93,20.45) v1(2.93,18.93) v1(4.45,34.17) v1(4.45,32.65) v1(4.45,31.12) v1(4.45,29.6) v1(4.45,28.07) v1(4.45,26.55) v1(4.45,25.03) v1(4.45,23.5) v1(4.45,21.98) v1(4.45,20.45) v1(5.97,34.17) v1(5.97,32.65) v1(5.97,31.12) v1(5.97,29.6) v1(5.97,28.07) v1(5.97,26.55) v1(5.97,25.03) v1(5.97,23.5) v1(5.97,21.98) v1(5.97,20.45) v1(5.97,18.93) v1(5.97,17.41) v1(7.5,34.17) v1(7.5,32.65) v1(7.5,31.12) v1(7.5,29.6) v1(7.5,28.07)
$C28_2:
  vias: v1(10.04,34.3) v1(10.04,32.77) v1(10.04,31.25) v1(10.04,29.73) v1(10.04,28.2) v1(11.56,34.3) v1(11.56,32.77) v1(11.56,31.25) v1(11.56,29.73) v1(11.56,28.2) v1(13.09,34.3) v1(13.09,32.77) v1(13.09,31.25) v1(13.09,29.73) v1(13.09,28.2) v1(13.09,26.68) v1(13.09,25.15) v1(13.09,23.63) v1(13.09,22.11) v1(13.09,20.58) v1(13.09,19.06) v1(14.61,34.3) v1(14.61,32.77) v1(14.61,31.25) v1(14.61,29.73) v1(14.61,28.2) v1(14.61,26.68) v1(14.61,25.15) v1(14.61,23.63) v1(14.61,22.11) v1(14.61,20.58) v1(14.61,19.06) v1(16.13,34.3) v1(16.13,32.77) v1(16.13,28.2) v1(16.13,26.68) v1(16.13,25.15) v1(16.13,23.63) v1(16.13,22.11) v1(16.13,20.58) v1(16.13,19.06) v1(17.66,34.3) v1(17.66,26.68) v1(17.66,25.15) v1(17.66,23.63) v1(17.66,22.11) v1(17.66,20.58) v1(17.66,19.06) v1(19.18,34.3) v1(19.18,32.77) v1(19.18,28.2) v1(19.18,26.68) v1(19.18,25.15) v1(19.18,23.63) v1(19.18,22.11) v1(19.18,20.58) v1(19.18,19.06) v1(20.71,34.3) v1(20.71,32.77) v1(20.71,31.25) v1(20.71,29.73) v1(20.71,28.2) v1(20.71,26.68) v1(20.71,25.15) v1(20.71,23.63) v1(20.71,22.11) v1(20.71,20.58) v1(20.71,19.06) v1(22.23,34.3) v1(22.23,32.77) v1(22.23,31.25) v1(22.23,29.73) v1(22.23,28.2) v1(22.23,26.68) v1(22.23,25.15) v1(22.23,23.63) v1(22.23,22.11) v1(22.23,20.58) v1(22.23,19.06) v1(23.75,34.3) v1(23.75,32.77) v1(23.75,31.25) v1(23.75,29.73) v1(23.75,28.2) v1(23.75,26.68) v1(23.75,25.15) v1(23.75,23.63) v1(23.75,22.11) v1(23.75,20.58) v1(23.75,19.06)
$C29_1: length 7.4
  Top Layer w0.381: C29.1 69.74,30.25 70.24,30.75 U5.4
  Top Layer w0.762: C29.1 68.29,29.19 D9.2 66.48,29.9 R37.1
$C29_2: length 6.8
  Top Layer w0.381: C29.2 69.85,31.75 U5.2
  Top Layer w0.762: D4.1 70.52,33.42 C29.2 69.31,32.29 D9.1
$C34_1: length 7.6
  Top Layer w0.381: U6.4 70.23,18.05 C34.1
  Top Layer w0.762: R46.1 67.24,16.57 ; 67.24,16.57 D10.2 ; 67.24,16.57 68.75,16.57 C34.1
$C34_2: length 7.1
  Top Layer w0.381: U6.2 70.23,19.05 C34.2
  Top Layer w0.762: C34.2 71.03,20.85 D8.1 ; C34.2 70.08,19.55 ; C34.2 67.53,19.55 D10.1
$C44_1: length 3.7
  Top Layer w0.254: U3.9 42.28,47.23 42.8,46.7 C44.1 44.23,46.23 FB2.2
$C44_2: length 4.3
  Top Layer w0.254: FB3.1 41.78,46.82 U3.8
  Top Layer w0.381: C44.2 42.8,44.8 FB3.1
$D5_1: length 1.2
  Top Layer w0.508: D5.1 R29.2
$D6_2: length 11.7
  Top Layer w0.762: R33.2 62.41,27.36 61.47,26.42 59.31,26.42 58.6,27.14 R34.1 58.6,29.97 D6.2
  Top Layer w1.778: D6.2 Q4.1
$D7_2: length 12.5
  Top Layer w0.762: R42.2 62.41,13.27 62.11,12.96 59.26,12.96 58.73,13.49 R43.1
  Top Layer w1.778: R43.1 58.73,16.5 D7.2 Q6.1
$D11_2: length 7.4
  Top Layer w0.762: Q5.1 64.3,38.49 D11.2 66.26,39.09 R38.2 67.44,37.9 67.44,36.15
$D12_2: length 7
  Top Layer w0.762: Q7.1 64.68,25.28 D12.2 65.25,25.15 R47.2 67.24,23.4 R48.1
$D13_1: length 1.9
  Top Layer w0.254: D13.1 30.74,48.81 R23.2
$D13_2: length 2.3
  Top Layer w0.254: D13.2 27.59,48.17 R22.2
$D13_3: length 2.1
  Top Layer w0.254: D13.3 26.17,49.32 R21.2
$D13_4: length 12.7
  Top Layer w0.254: D13.4 23.41,47.25 31.25,47.25 33.79,49.79 R25.2
$D13_5: length 17.2
  Top Layer w0.254: R26.2 34.41,48.9 33.53,48.9 31.37,46.74 21.38,46.74 D13.5
$D13_6: length 2.1
  Top Layer w0.762: Q3.3 19.31,55.16 D13.6
$D13_7: length 5.9
  Top Layer w0.254: D13.7 25.28,53 25.28,51.94 R19.2
$D13_8: length 5.6
  Top Layer w0.254: D13.8 27.69,53.13 R20.2
$D13_9: length 4.7
  Bottom Layer w0.254: D13.9 24.36,52.59 v1(24.2,52.59)
$D13_10: length 5.4
  Top Layer w0.254: R24.2 32.26,53.64 D13.10
$P2_1: length 10.7
  Top Layer w0.762: R41.2 90.68,53.86 v1(90.8,53.98)
  Bottom Layer w0.254: P2.1 92.59,53.98 v1(90.8,53.98)
$P3_2: length 2.7
  Top Layer w1.016: Q1.3 90.06,47.52 P3.2
$PWR1_2: length 1.4
  Top Layer w0.254: R5.1 6.61,50.94 v1(6.61,50.95)
$Q1_1: length 3
  Top Layer w0.762: 89.35,49.52 89.35,50.74 R13.1 R12.2
$Q2_1: length 4.3
  Top Layer w0.508: Q2.1 22.73,52.5 22.73,50.17 R14.1
$Q3_1: length 1.7
  Top Layer w0.762: Q3.1 18.56,51.22 R15.1
$R1_1: length 3.2
  Top Layer w0.508: R1.1 87.89,38.39 87.85,38.35 ; R2.2 87.85,38.35 ; 87.85,38.35 U1.5
$R3_2: length 2.5
  Top Layer w0.508: R3.2 88.02,33.8 87.25,33.04 U1.4
$R4_2: length 2.2
  Top Layer w0.508: R4.2 85.98,39.39 U1.6
$R6_1: length 1.5
  Top Layer w0.762: R6.1 R7.2
$R9_2: length 4.4
  Top Layer w0.254: v1(6.06,56.84) 7.05,56.84 R9.2 R10.2 9.88,56.51 v1(10.21,56.84)
$R11_2: length 1.6
  Bottom Layer w0.254: v1(7.95,50.9) 9.48,50.9 STA1.2
$R27_1: length 3.1
  Top Layer w0.508: U4.1 85.64,18.54 R27.1 R28.2
$R31_2: length 1.7
  Top Layer w0.508: U4.6 85.84,22 R31.2
$R33_1: length 11.9
  Top Layer w0.381: R33.1 71.25,27.95 72.78,29.47 72.78,30.88 72.41,31.25 U5.3
$R38_1: length 12
  Top Layer w0.381: v1(69.17,38.11) 70.31,39.25 71.63,39.25 76.2,34.68 76.2,32.59 U5.10
$R42_1: length 12.5
  Top Layer w0.381: U6.3 72.78,18.55 73.28,18.04 73.28,17.41 70.49,14.61 R42.1
$R47_1: length 13.1
  Top Layer w0.381: U6.10 76.12,19.99 76.59,20.45 76.59,24.9 76.33,25.15 R47.1
$R49_1: length 1.4
  Top Layer w0.381: U5.6 75.87,28.89 R49.1
$R50_1: length 1.4
  Top Layer w0.254: U6.6 76.12,16.19 R50.1
DBGRX: length 17.1
  Top Layer w0.254: P4.9 52.47,48.66 45.84,48.66 U3.13
DBGTX: length 21
  Top Layer w0.254: U3.12 43.9,48.18 43.99,48.27 52.84,48.27 58.81,54.24 60.97,54.24 61.6,54.87 P4.7
DIG1: length 34.4
  Top Layer w0.254: v1(40.26,49.66) 40.77,50.17 43.6,50.17 43.82,49.95 U3.14
  Bottom Layer w0.254: v1(21.56,49.79) 20.93,50.43 19.69,50.43 18.93,49.66 18.93,47.38 20.33,45.98 32.64,45.98 36.78,50.12 39.04,50.12 39.5,49.66 v1(40.26,49.66)
DIG2: length 28.6
  Top Layer w0.254: v1(39.88,50.55) 43.82,50.55 43.95,50.43 45.02,50.43 U3.15
  Bottom Layer w0.254: v1(39.88,50.55) 36.58,50.55 32.39,46.36 22.86,46.36 21.47,47.76 21.47,48.39 v1(20.06,49.79)
DIGA: length 24.9
  Top Layer w0.178: v1(41.03,51.19) 41.28,50.93 43.69,50.93 43.95,51.19 43.95,51.7 44.2,51.95 U3.18
  Bottom Layer w0.254: v1(24.64,49.8) 25.02,49.8 25.91,48.9 25.91,47.76 26.8,46.87 32.26,46.87 36.58,51.19 v1(41.03,51.19)
DIGB: length 21.5
  Top Layer w0.254: v1(41.79,51.57) 41.91,51.44 43.09,51.44 44.1,52.45 U3.19
  Bottom Layer w0.254: v1(41.79,51.57) 41.59,51.77 36.4,51.77 31.88,47.25 29.09,47.25 28.71,47.63 28.71,48.78 v1(27.69,49.8)
DIGC: length 21.5
  Top Layer w0.254: v1(42.55,52.08) 42.97,52.08 43.84,52.95 U3.20
  Bottom Layer w0.178: v1(42.55,52.08) 42.42,52.2 35.95,52.2 32.9,49.16 29.6,49.16 27.45,51.31 v1(26.17,51.31)
DIGD: length 9
  Top Layer w0.254: U3.39 36.97,53.98 35.95,53.98 v1(35.56,54.36)
  Bottom Layer w0.381: 35.31,54.49 32.4,54.49 v1(29.22,51.31)
DIGDP: length 2
  Top Layer w0.254: U3.43 35.96,51.95 R26.1
DIGE: length 7.3
  Top Layer w0.254: U3.40 35.84,53.45 35.7,53.6 v1(35.06,53.6)
  Bottom Layer w0.254: v1(35.06,53.6) 33.03,53.6 v1(30.74,51.31)
DIGF: length 7.2
  Top Layer w0.254: U3.41 36.05,52.95 36.04,52.97 v1(34.55,52.97)
  Bottom Layer w0.254: v1(32.26,49.8) 32.26,51.7 33.53,52.97 v1(34.55,52.97)
DIGG: length 4.4
  Top Layer w0.254: U3.42 37,52.46 35.18,52.46 34.8,52.08 34.17,52.08 v1(33.91,52.33)
  Bottom Layer w0.254: v1(33.91,52.33) 33.91,51.48 v1(33.79,51.35)
EN: length 59.6
  Top Layer w0.254: U3.38 37.98,54.45 37.98,54.2 38.49,53.69 38.49,53.09 v1(38.61,52.97) 39.68,51.9 41.22,51.9 42.68,53.35 v1(42.68,54.11)
  Bottom Layer w0.254: v1(89.29,53.98) 86.5,56.78 57.03,56.78 51.85,51.59 48.48,51.59 45.97,54.11 v1(42.68,54.11)
FAN: length 60.6
  Top Layer w0.254: v1(52.07,49.28) 53.85,51.06 v1(53.85,51.7) ; U3.31 40.78,55.38 40.52,55.13 40.52,54.87 40.9,54.49 40.9,53.98 v1(41.15,53.73)
  Bottom Layer w0.254: v1(41.15,53.73) 41.36,53.52 46.05,53.52 48.39,51.19 53.09,51.19 53.6,51.7 v1(53.85,51.7) ; P5.6 56.65,49.28 v1(52.07,49.28)
  Bottom Layer w0.381: v1(87.6,52.46) 87.34,52.71 72.52,52.71 71.08,51.27 69.18,51.27 65.54,47.63 65.54,46.62 64.65,45.73 60.2,45.73 P5.6
LCCA: length 24.6
  Top Layer w0.762: R34.2 60.53,29.73 61.55,30.74 D6.1 ; D6.1 61.09,32.48 61.09,34.55 Q5.2 ; D6.1 63.93,31.83 R37.2
  Top Layer w1.778: Q4.3 Q5.2
  Bottom Layer w1.778: Q4.3 Q5.2
LCCB: length 24.3
  Top Layer w0.762: D7.1 60.71,19.53 60.71,20.96 Q7.2 ; D7.1 63.25,17.53 64.22,18.5 R46.2 ; D7.1 62.44,17.53 61.24,16.33 61.24,15.19 R43.2
  Top Layer w1.778: Q6.3 Q7.2
  Bottom Layer w1.778: Q6.3 Q7.2
LED: length 33.3
  Top Layer w0.254: U3.45 36.22,50.95 35.82,50.55 24.01,50.55 23.25,51.32 23.25,53.6 22.39,54.46 21.18,54.46 20.8,54.07 20.8,53.31 19.81,52.32 17.52,52.32 16.01,50.81 11.28,50.81 v1(9.54,52.55)
MOD: length 39.3
  Top Layer w0.254: R10.1 9.05,55.01 11.48,52.59 16.13,52.59 17.15,53.6 17.91,53.6 18.29,53.98 18.29,56.14 19.56,57.41 32.52,57.41 v1(32.9,57.03) ; v1(41.28,55) 41.28,55 U3.30
  Bottom Layer w0.254: v1(32.9,57.03) 32.9,56.4 34.29,55 v1(41.28,55)
PC: length 60.7
  Top Layer w0.254: 61.86,46.61 61.86,47.37 61.33,47.9 44.98,47.9 44.2,47.13 43.38,47.13 43.28,47.23 U3.11
  Top Layer w0.381: v1(81.16,29.85) 80.27,30.74 80.27,34.03 69.46,44.84 63.63,44.84 P5.5
  Top Layer w0.508: v1(86.8,26.12) 87.12,25.8 C25.1 R31.1
  Bottom Layer w0.381: v1(86.8,26.12) 86.8,26.24 83.19,29.85 v1(81.16,29.85)
PV: length 59
  Top Layer w0.254: U3.10 42.78,49.51 v1(42.8,49.54)
  Top Layer w0.381: 81.81,27.92 C43.2 82.3,27.71 82.3,29.98 81.79,30.49 81.41,30.49 80.9,31 80.9,34.2 69.76,45.35 65.66,45.35 P5.4
  Top Layer w0.508: C43.2 82.43,27.3 R29.1
  Bottom Layer w0.254: v1(42.8,49.54) 43.13,49.87 61.14,49.87 P5.4
PWMEN: length 62.1
  Top Layer w0.254: 47.25,49.41 47,49.66 47,50.43 45.97,51.45 U3.17
  Top Layer w0.381: U5.7 76.95,30.75 R36.1 78.39,29.31 ; 78.39,29.31 78.39,33.7 68.77,43.31 55,43.31 P5.9 ; 78.39,29.31 78.5,29.2 78.5,18.42 78.13,18.05 U6.7
  Bottom Layer w0.254: P5.9 49.53,46.87 47.25,49.16 v1(47.25,49.28)
PWMINA: length 58.9
  Top Layer w0.254: v1(46.36,49.28) 46.36,50.43 45.83,50.95 U3.16
  Top Layer w0.381: v1(80.01,29.85) 79.63,30.23 79.63,33.95 69.25,44.33 59.06,44.33 P5.7 ; R35.1 76.96,31.25 U5.8 74.92,31.25 74.68,31.01 v1(74.68,30.11)
  Bottom Layer w0.254: v1(46.36,49.28) 49.53,46.11 49.92,46.11 50.3,45.73 51.95,45.73 52.71,46.49 52.71,47.38 53.47,48.14 55.25,48.14 P5.7
  Bottom Layer w0.381: v1(74.68,30.11) 75.44,29.34 79.51,29.34 v1(80.01,29.85)
PWMINB: length 89.1
  Top Layer w0.254: v1(40.26,52.84) 41.66,52.84 42.04,53.22 42.04,54.49 42.3,54.74 42.3,54.87 41.78,55.39 U3.29
  Top Layer w0.381: R44.1 77.21,18.55 U6.8 74.94,18.55 74.55,18.17 74.55,17.53 73.66,16.64 73.66,15.63 74.17,15.12 76.97,15.12 77.73,15.88 77.73,16.52 79,17.79 79,33.9 69.08,43.82 57.03,43.82 P5.8
  Bottom Layer w0.254: P5.8 53.73,46.87 52.11,45.26 45.43,45.26 44.2,46.49 42.04,46.49 41.15,47.38 41.15,49.92 42.04,50.81 42.3,50.81 43.44,51.95 43.44,52.2 42.93,52.71 42.04,52.71 41.91,52.59 40.52,52.59 v1(40.26,52.84)
RST: length 28.3
  Top Layer w0.254: C19.2 v1(45.85,46.23) ; v1(41.91,49.54) 41.53,49.54 41.28,49.28 U3.7
  Bottom Layer w0.254: 59.06,52.71 56.57,50.22 42.6,50.22 v1(41.91,49.54) 41.91,47.51 42.17,47.25 44.84,47.25 45.85,46.24 v1(45.85,46.23)
SWCLK: length 34.9
  Top Layer w0.254: U3.37 38.08,54.95 38.42,54.62 38.42,54.49 39.38,53.54 v1(39.38,53.22)
  Bottom Layer w0.254: 66.68,52.71 65.66,51.7 61.09,51.7 60.33,52.46 60.33,52.97 59.44,53.86 57.79,53.86 54.77,50.83 48.24,50.83 45.94,53.13 ; v1(39.38,53.22) 39.63,53.22 40.01,53.6 40.45,53.6 40.96,53.09 45.91,53.09 45.94,53.13
SWDIO: length 38.5
  Top Layer w0.254: v1(40.26,54.24) 40.14,54.36 40.14,54.74 39.76,55.13 39.63,55.13 39.28,55.48 U3.34 ; v1(53.6,54.74) 56.01,57.16 66.55,57.16 67.95,55.76 67.95,53.98 69.22,52.71
  Bottom Layer w0.254: v1(53.6,54.74) 53.6,53.98 51.57,51.95 48.65,51.95 45.6,55 42.42,55 41.79,54.36 40.39,54.36 v1(40.26,54.24)

## Copper pours and planes (outline as drawn; the poured copper is in the pictures)
GND on Top Layer: 73.16,59.82 105.29,59.82 105.29,-1.52 73.16,-1.52
GND on Top Layer: 50.91,41.03 108.34,41.03 108.34,9.91 50.91,9.91
GND on Bottom Layer: 73.16,59.82 105.29,59.82 105.29,-1.52 73.16,-1.52
GND on Bottom Layer: 52.66,41.03 74.05,41.03 74.05,-3.42 52.66,-3.42
GNDMCU on Top Layer: -0.76,60.33 72.86,60.33 72.86,40.83 -0.76,40.83
GNDMCU on Bottom Layer: -0.76,60.33 72.86,60.33 72.86,40.83 -0.76,40.83
VBAT on Top Layer: 99.52,24.47 99.52,20.05 99.34,19.86 89.54,19.86 87.99,21.41 87.99,27.19 90.05,30.74 91.32,30.74 92.72,32.14 92.72,33.49 99.11,33.49 99.57,33.03 99.57,30.23 99.19,29.85 96.53,29.85 95,28.33 94.24,28.33 93.73,27.82 93.73,24.39 93.98,24.14 99.19,24.14
VBAT on Top Layer: 99.45,31.38 93.02,31.38 92.59,30.95 92.59,24.51 93.23,23.86 99.31,23.86 99.52,23.65 99.52,31.3
VBATO on Top Layer: 88.25,18.25 91.74,18.25 91.85,18.14 91.85,17.22 93.84,15.22 93.84,12.02 92.5,10.68 92.33,10.68 92.33,3.06 90.94,1.66 45.09,1.66 36.96,9.79 36.96,35.95 41.53,40.52 53.09,40.52 56.39,37.22 58.04,37.22 58.68,36.58 58.68,35.44 58.04,34.81 57.03,34.81 56.51,34.29 56.51,31.32 52.78,31.32 52.58,31.12 52.58,27.52 53.09,27.01 55.55,27.01 56.01,26.55 56.01,24.9 56.9,24.01 58.04,24.01 58.68,23.38 58.68,22.23 58.17,21.72 57.29,21.72 56.26,20.69 56.26,18.34 55.58,17.66 52.5,17.66 52.2,17.37 52.2,14.23 55.88,10.55 82.43,10.55 88.25,16.37
VCC12V on Top Layer: 78.62,47.38 78.62,44.84 78.87,44.58 86,44.58 86.59,43.99 86.59,43.77 86.79,43.57 87.63,43.57 87.89,43.31 87.89,42.18 87.51,42.18 87.23,41.91 87.23,40.78 87.49,40.52 89.03,40.52 89.41,40.14 91.32,40.14 91.57,40.39 91.57,44.28 92.06,44.77 94.35,44.77 95.71,46.12 95.71,49.74 94.98,50.47 92.44,50.47 92.06,50.09 92.06,48.12 90.81,46.87 86.63,46.87 86,47.51 78.75,47.51
VCC12V on Top Layer: 70.24,38.49 70.24,36.46 70.49,36.2 71.76,36.2 71.89,36.33 71.89,38.49
VCC12V on Bottom Layer: 70.24,38.49 70.24,36.46 70.49,36.2 71.76,36.2 71.89,36.33 71.89,38.49
$C1_2 on Top Layer: 83.9,36.63 82.95,36.63 82.52,36.2 79.13,36.2 78.75,36.58 78.75,41.03 83.85,41.03 83.9,41.08
$C6_1 on Top Layer: 84.33,33.28 86.37,33.28 86.37,31.5 86.49,31.38 88.02,31.38 88.02,33.15 89.26,33.17 89.79,33.7 89.79,35.89 90.11,36.2 93.22,36.2 93.86,36.84 93.86,38.36 94.22,38.72 95.91,38.72 96.27,38.36 96.27,34.3 95.51,33.54 92.57,33.54 92.53,33.49 92.53,32.15 91.24,30.86 89.91,30.86 89.03,29.34 85.86,29.34 84.08,31.12 84.08,33.03
$C28_1 on Top Layer: -0.12,35.44 8.77,35.44 8.77,15.88 -0.12,15.88
$C28_1 on Bottom Layer: -0.12,35.44 8.77,35.44 8.77,15.88 -0.12,15.88
$C28_2 on Top Layer: 10.04,35.44 24.13,35.44 24.13,16.01 10.04,16.01
$C28_2 on Bottom Layer: 10.04,35.44 24.13,35.44 24.13,16.01 10.04,16.01
LCCA on Bottom Layer: 58.91,37.67 59.02,37.78 59.02,39.29 54.62,43.7 33.66,43.7 24.64,34.68 24.64,16.39 24.9,16.14 29.22,16.14 29.34,16.01 40.65,27.31 52.71,27.06 52.71,29.85 56.27,29.85 56.27,37.09 58.63,37.09 59.21,37.67
LCCB on Top Layer: -2.53,15.5 28.58,15.5 28.58,-1.52 -2.53,-1.52
LCCB on Bottom Layer: 26.17,-0.25 47.66,-0.25 55.93,8.02 55.93,23.63 56.19,23.88 58.33,23.88 59.01,24.57 59.01,26.09 58.43,26.68 56.77,26.68 56.65,26.8 40.52,26.8 29.09,15.37 28.2,15.37 26.17,13.34
LCCB on Bottom Layer: -1.27,15.5 28.58,15.5 28.58,-1.52 -1.27,-1.52

Small or netless copper shapes (teardrops, artwork), in the pictures only: 280 on Top Layer, 68 on Bottom Layer
